# Altium schematic sheet CTR_PAD.SchDoc
size A2; SheetNumber: 1; SheetTotal: 1
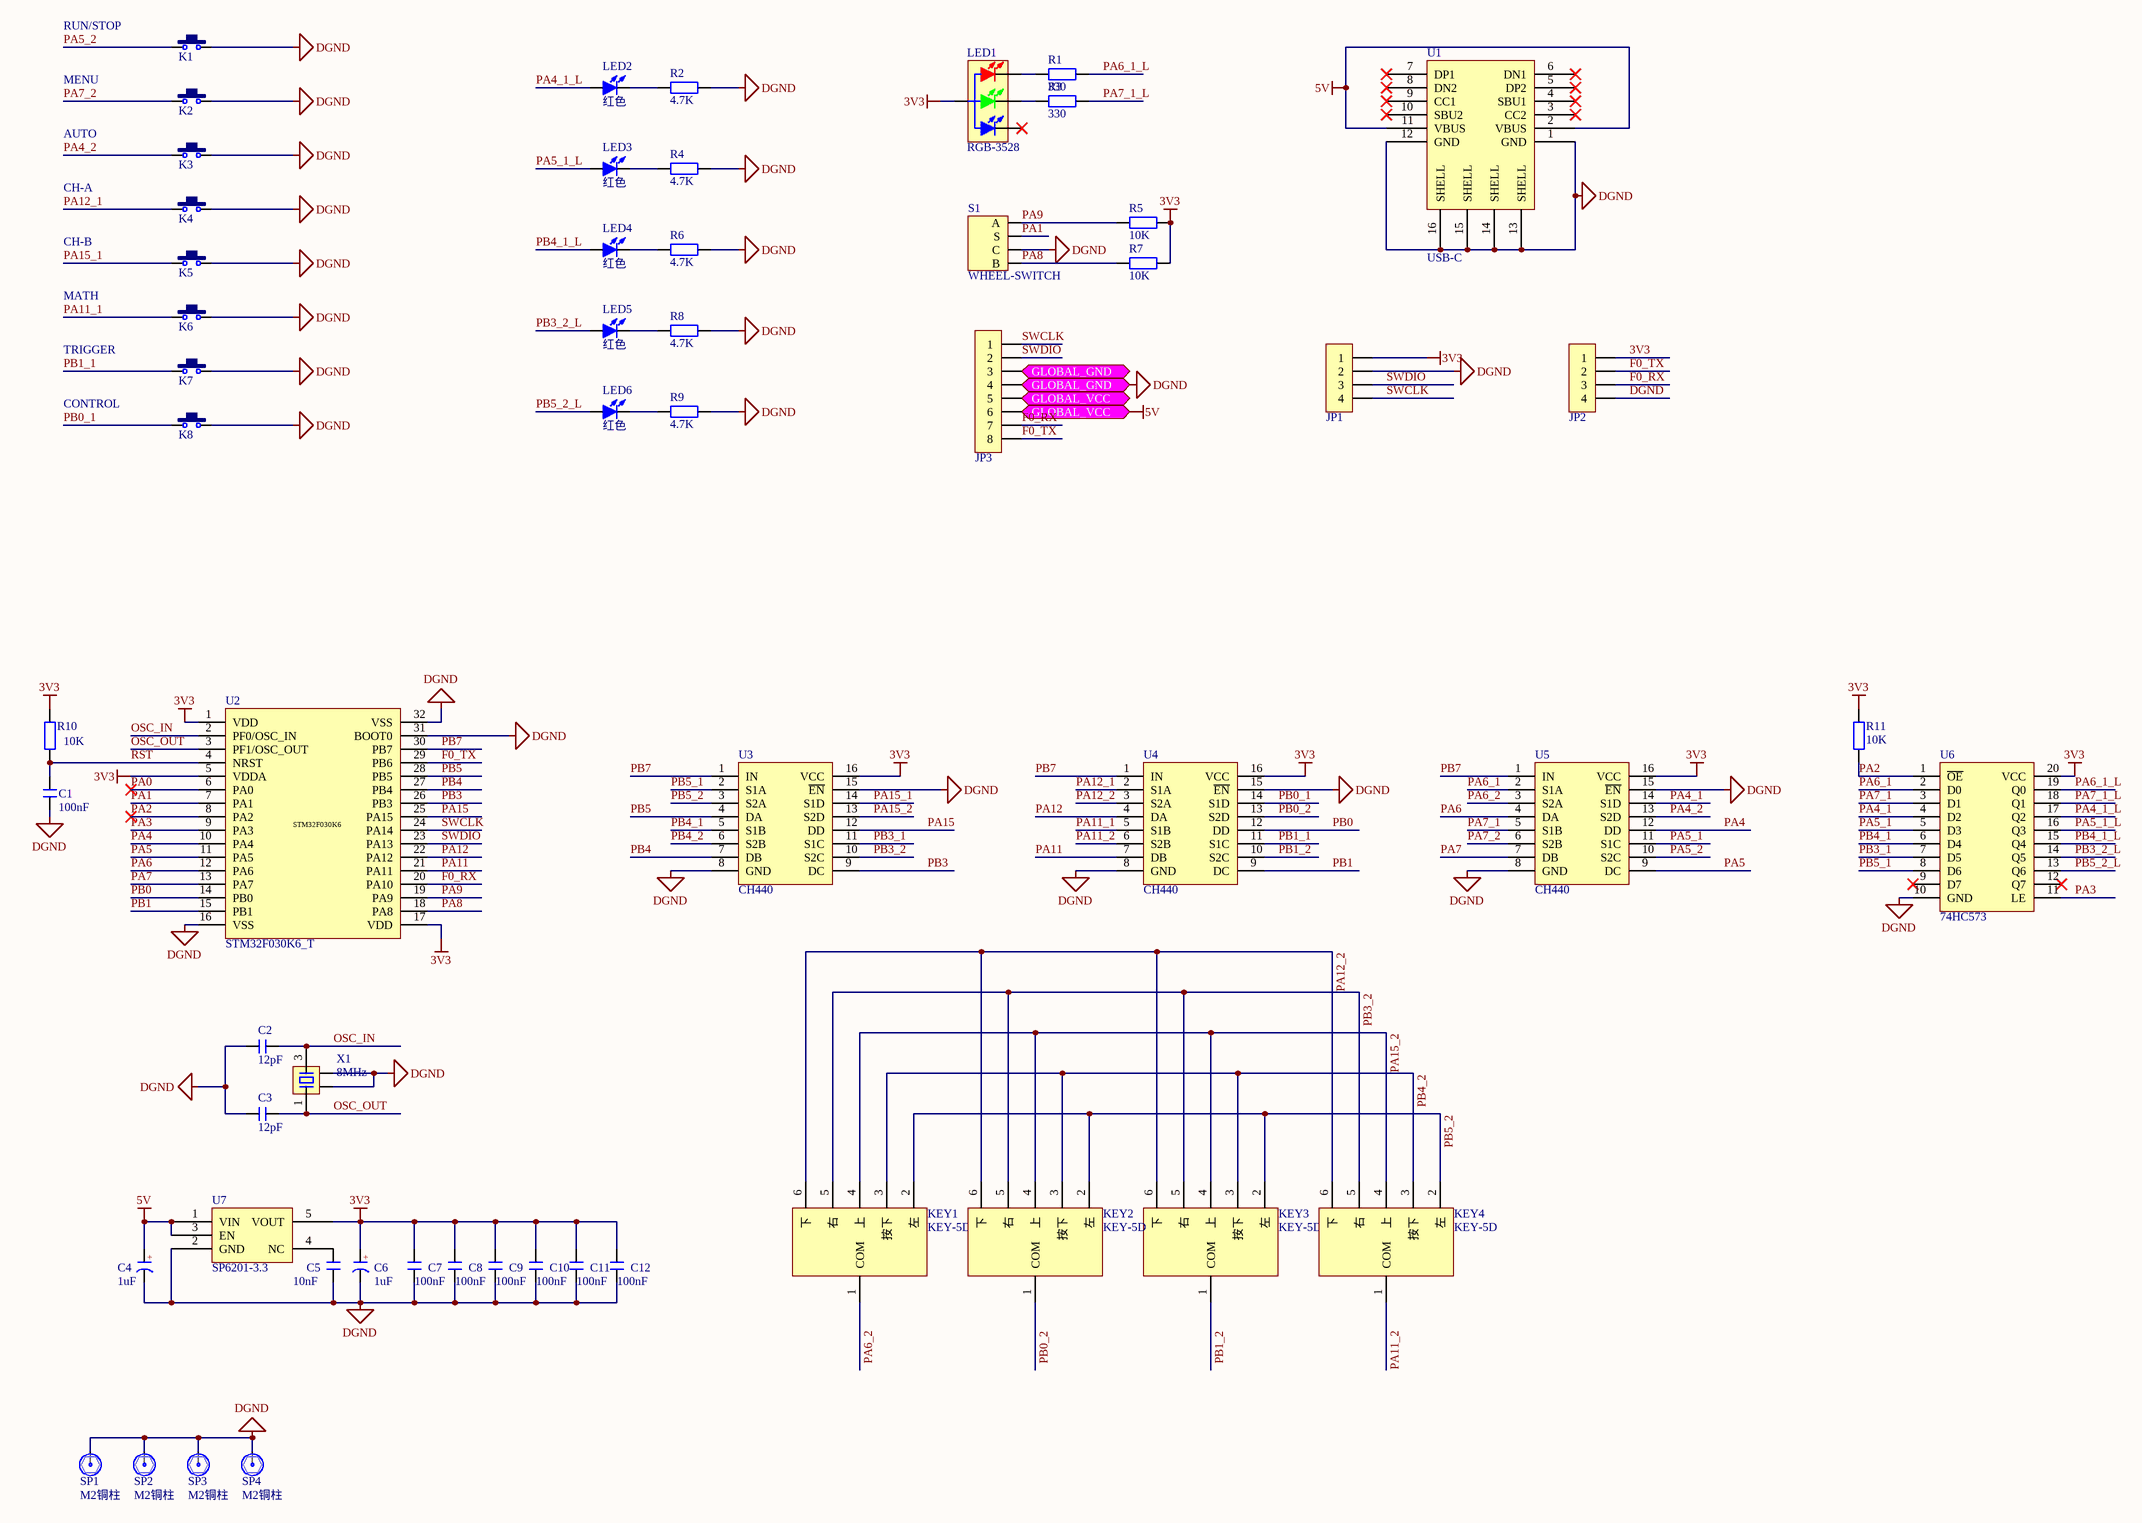
[diagram p0: CTR_PAD.SchDoc]

## Parts
C1  100nF  [C 0603_L]
C2  12pF  [C 0603_L]
C3  12pF  [C 0603_L]
C4  1uF  [CD A(3216)]
C5  10nF  [C 0603_L]
C6  1uF  [CD A(3216)]
C7  100nF  [C 0603_L]
C8  100nF  [C 0603_L]
C9  100nF  [C 0603_L]
C10  100nF  [C 0603_L]
C11  100nF  [C 0603_L]
C12  100nF  [C 0603_L]
JP1  HDR-1X4  [MX 1.25-WS-4P]  (value not drawn)
JP2  HDR-1X4  [HDR2.54-LI-4P]  (value not drawn)
JP3  FPC1.0-8P  [FPC0.5 2H-WS-8P]  (value not drawn)
K1  6x6x5  [TSW SMD-6*6*4.3]  (value not drawn)
K2  6x6x5  [TSW SMD-6*6*4.3]  (value not drawn)
K3  6x6x5  [TSW SMD-6*6*4.3]  (value not drawn)
K4  6x6x5  [TSW SMD-6*6*4.3]  (value not drawn)
K5  6x6x5  [TSW SMD-6*6*4.3]  (value not drawn)
K6  6x6x5  [TSW SMD-6*6*4.3]  (value not drawn)
K7  6x6x5  [TSW SMD-6*6*4.3]  (value not drawn)
K8  6x6x5  [TSW SMD-6*6*4.3]  (value not drawn)
KEY1  KEY-5D  [KEY-5D-SMD]
KEY2  KEY-5D  [KEY-5D-SMD]
KEY3  KEY-5D  [KEY-5D-SMD]
KEY4  KEY-5D  [KEY-5D-SMD]
LED1  RGB-3528  [LED 3528-4Pin]
LED2  红色  [LED 0805Y]
LED3  红色  [LED 0805Y]
LED4  红色  [LED 0805R]
LED5  红色  [LED 0805R]
LED6  红色  [LED 0805R]
R1  330  [R 0603_L]
R2  4.7K  [R 0603_L]
R3  330  [R 0603_L]
R4  4.7K  [R 0603_L]
R5  10K  [R 0603_L]
R6  4.7K  [R 0603_L]
R7  10K  [R 0603_L]
R8  4.7K  [R 0603_L]
R9  4.7K  [R 0603_L]
R10  10K  [R 0603_L]
R11  10K  [R 0603_L]
S1  WHEEL-SWITCH  [WHEEL-SWITCH]
SP1  M2铜柱  [M2]
SP2  M2铜柱  [M2]
SP3  M2铜柱  [M2]
SP4  M2铜柱  [M2]
U1  USB-C  [USB-C-16]
U2  STM32F030K6_T  [LQFP32 7X7_N]
U3  CH440  [SOP16_L]
U4  CH440  [SOP16_L]
U5  CH440  [SOP16_L]
U6  74HC573  [TSSOP20_L]
U7  SP6201-3.3  [SOT23-5L]
X1  8MHz  [OSC 3225-4P]

## Ports
GLOBAL_GND (bidir), GLOBAL_VCC (bidir)

## Nets
3V3: C6.1(A) C7.2 C8.2 C9.2 C10.2 C11.2 C12.2 JP1.1 JP2.1 LED1.4(A) R5.1 R7.2 R10.1 R11.1 U2.1(VDD) U2.5(VDDA) U2.17(VDD) U3.16(VCC) U4.16(VCC) U5.16(VCC) U6.20(VCC) U7.5(VOUT)
5V: C4.1(A) JP3.5 JP3.6 U1.2(VBUS) U1.11(VBUS) U7.1(VIN) U7.3(EN) ; port GLOBAL_VCC
DGND: C1.1 C2.1 C3.1 C4.2(K) C5.1 C6.2(K) C7.1 C8.1 C9.1 C10.1 C11.1 C12.1 JP1.2 JP2.4 JP3.3 JP3.4 K1.2 K2.2 K3.2 K4.2 K5.2 K6.2 K7.2 K8.2 R2.1 R4.1 R6.1 R8.1 R9.1 S1.C SP1.1 SP2.1 SP3.1 SP4.1 U1.1(GND) U1.12(GND) U1.13(SHELL) U1.14(SHELL) U1.15(SHELL) U1.16(SHELL) U2.16(VSS) U2.31(BOOT0) U2.32(VSS) U3.8(GND) U3.15(~{EN}) U4.8(GND) U4.15(~{EN}) U5.8(GND) U5.15(~{EN}) U6.10(GND) U7.2(GND) X1.2 X1.4 ; port GLOBAL_GND
F0_RX: JP2.3 JP3.7 U2.20(PA10)
F0_TX: JP2.2 JP3.8 U2.29(PB6)
OSC_IN: C2.2 U2.2(PF0/OSC_IN) X1.3
OSC_OUT: C3.2 U2.3(PF1/OSC_OUT) X1.1
PA0: U2.6(PA0)
PA1: S1.S U2.7(PA1)
PA2: R11.2 U2.8(PA2) U6.1(~{OE})
PA3: U2.9(PA3) U6.11(LE)
PA4: U2.10(PA4) U5.12(DD)
PA4_1: U5.14(S1D) U6.4(D2)
PA4_1_L: LED2.1(A) U6.17(Q2)
PA4_2: K3.1 U5.13(S2D)
PA5: U2.11(PA5) U5.9(DC)
PA5_1: U5.11(S1C) U6.5(D3)
PA5_1_L: LED3.1(A) U6.16(Q3)
PA5_2: K1.1 U5.10(S2C)
PA6: U2.12(PA6) U5.4(DA)
PA6_1: U5.2(S1A) U6.2(D0)
PA6_1_L: R1.1 U6.19(Q0)
PA6_2: KEY1.1(COM) U5.3(S2A)
PA7: U2.13(PA7) U5.7(DB)
PA7_1: U5.5(S1B) U6.3(D1)
PA7_1_L: R3.1 U6.18(Q1)
PA7_2: K2.1 U5.6(S2B)
PA8: R7.1 S1.B U2.18(PA8)
PA9: R5.2 S1.A U2.19(PA9)
PA11: U2.21(PA11) U4.7(DB)
PA11_1: K6.1 U4.5(S1B)
PA11_2: KEY4.1(COM) U4.6(S2B)
PA12: U2.22(PA12) U4.4(DA)
PA12_1: K4.1 U4.2(S1A)
PA12_2: KEY1.6(下) KEY2.6(下) KEY3.6(下) KEY4.6(下) U4.3(S2A)
PA15: U2.25(PA15) U3.12(DD)
PA15_1: K5.1 U3.14(S1D)
PA15_2: KEY1.4(上) KEY2.4(上) KEY3.4(上) KEY4.4(上) U3.13(S2D)
PB0: U2.14(PB0) U4.12(DD)
PB0_1: K8.1 U4.14(S1D)
PB0_2: KEY2.1(COM) U4.13(S2D)
PB1: U2.15(PB1) U4.9(DC)
PB1_1: K7.1 U4.11(S1C)
PB1_2: KEY3.1(COM) U4.10(S2C)
PB3: U2.26(PB3) U3.9(DC)
PB3_1: U3.11(S1C) U6.7(D5)
PB3_2: KEY1.5(右) KEY2.5(右) KEY3.5(右) KEY4.5(右) U3.10(S2C)
PB3_2_L: LED5.1(A) U6.14(Q5)
PB4: U2.27(PB4) U3.7(DB)
PB4_1: U3.5(S1B) U6.6(D4)
PB4_1_L: LED4.1(A) U6.15(Q4)
PB4_2: KEY1.3(按下) KEY2.3(按下) KEY3.3(按下) KEY4.3(按下) U3.6(S2B)
PB5: U2.28(PB5) U3.4(DA)
PB5_1: U3.2(S1A) U6.8(D6)
PB5_2: KEY1.2(左) KEY2.2(左) KEY3.2(左) KEY4.2(左) U3.3(S2A)
PB5_2_L: LED6.1(A) U6.13(Q6)
PB7: U2.30(PB7) U3.1(IN) U4.1(IN) U5.1(IN)
RST: C1.2 R10.2 U2.4(NRST)
SWCLK: JP1.4 JP3.1 U2.24(PA14)
SWDIO: JP1.3 JP3.2 U2.23(PA13)
NetC5_2: C5.2 U7.4(NC)
NetLED1_1: LED1.1(RED_K) R1.2
NetLED1_2: LED1.2(GREEN_K) R3.2
NetLED2_2: LED2.2(K) R2.2
NetLED3_2: LED3.2(K) R4.2
NetLED4_2: LED4.2(K) R6.2
NetLED5_2: LED5.2(K) R8.2
NetLED6_2: LED6.2(K) R9.2

Not connected (* = marked no-connect by the designer): LED1 3(BULE_K)*; U1 3(CC2)* 4(SBU1)* 5(DP2)* 6(DN1)* 7(DP1)* 8(DN2)* 9(CC1)* 10(SBU2)*; U6 9(D7)* 12(Q7)*

## Notes on the sheet
- RUN/STOP
- AUTO
- MENU
- CH-A
- CH-B
- MATH
- TRIGGER
- CONTROL
- (in symbol C-CD) +
- (in symbol STM32F030K6_T) STM32F030K6

## Library data of the parts
C1-C3 C5 C7-C12 = C: 无极性贴片电容; 版权归属: 源创客; BOM名称: 无极性贴片电容; 学习资源: www.ooocke.com
C4 C6 = C-CD: 贴片钽电容; 版权归属: 源创客; BOM名称: 贴片钽电容; 学习资源: www.ooocke.com
JP1 JP2 = Header 4: 4P接插件; 版权归属: 源创客; BOM名称: 4P接插件; 学习资源: www.ooocke.com
JP3 = FPC-8P: FPC连接器; 版权归属: 源创客; BOM名称: FPC连接器; 学习资源: www.ooocke.com
K1-K8 = KEY-SMD-6x6: 贴片6x6轻触开关; 版权归属: 源创客; BOM名称: 贴片6x6轻触开关; 学习资源: www.ooocke.com
KEY1-KEY4 = KEY-5D: 五向按键
LED1 = LED-RGB-3528: 三基色LED; 版权归属: 源创客; BOM名称: 三基色LED; 学习资源: www.ooocke.com
LED2-LED6 = LED-SMD: 贴片LED; 版权归属: 源创客; BOM名称: 贴片LED; 学习资源: www.ooocke.com
R1-R11 = R: 贴片电阻; 版权归属: 源创客; BOM名称: 贴片电阻; 学习资源: www.ooocke.com
S1 = WHEEL-SWITCH: 拨盘编码器
SP1-SP4 = M2铜柱: BOM名称: 铜柱; 版权归属: 源创客; 学习资源: www.ooocke.com
U1 = USB-C-16P: USB-C型母接口; 版权归属: 源创客; BOM名称: USB-C型母接口; 学习资源: www.ooocke.com
U2 = STM32F030K6_T: 微型控制器
U3-U5 = CH440: 四路2选1模拟开关
U6 = 74HC573: 8位三态锁存器
U7 = SP6201-3.3: 线性稳压器
X1 = XTAL-4P: 4脚无源晶振; 版权归属: 源创客; BOM名称: 4脚无源晶振; 学习资源: www.ooocke.com